# Altium schematic sheet board_Two.SchDoc
size A4; SheetNumber: 1; SheetTotal: 1
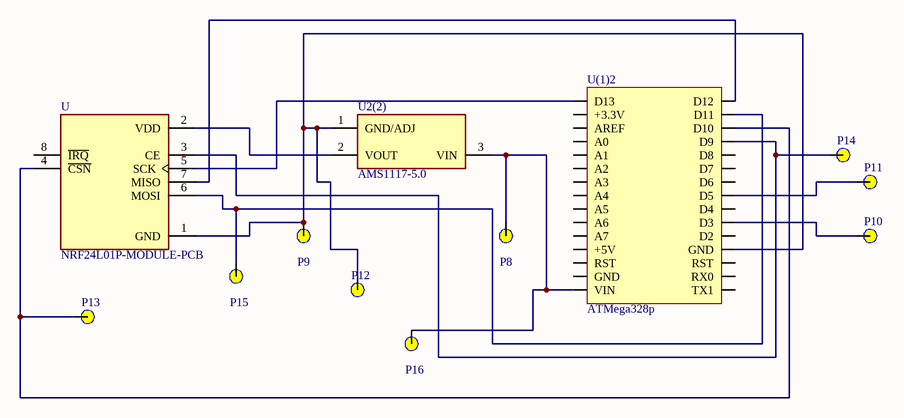
[diagram p0: board_Two.SchDoc]

## Parts
P8  PIN_1  [PCB_Pin_1]  (value not drawn)  (no BOM)
P9  PIN_1  [PCB_Pin_1]  (value not drawn)  (no BOM)
P10  PIN_1  [PCB_Pin_1]  (value not drawn)  (no BOM)
P11  PIN_1  [PCB_Pin_1]  (value not drawn)  (no BOM)
P12  PIN_1  [PCB_Pin_1]  (value not drawn)  (no BOM)
P13  PIN_1  [PCB_Pin_1]  (value not drawn)  (no BOM)
P14  PIN_1  [PCB_Pin_1]  (value not drawn)  (no BOM)
P15  PIN_1  [PCB_Pin_1]  (value not drawn)  (no BOM)
P16  PIN_1  [PCB_Pin_1]  (value not drawn)  (no BOM)
U  NRF24L01P-MODULE-PCB  [XCVR_NRF24L01P-MODULE-PCB]
U2(2)  AMS1117-5.0  [SOT229P700X180-4N]
U(1)2  ATMega328p  [PCB_ATMega328p]  (no BOM)

## Nets
NetP8_0: P8.0(Pin) P16.0(Pin) U2(2).3(VIN) U(1)2.0(VIN)
NetP9_0: P9.0(Pin) P12.0(Pin) U.1(GND) U2(2).1(GND/ADJ) U(1)2.26(GND)
NetP10_0: P10.0(Pin) U(1)2.24(D3)
NetP11_0: P11.0(Pin) U(1)2.22(D5)
NetP13_0: P13.0(Pin) U.4(~{CSN}) U(1)2.17(D10)
NetP14_0: P14.0(Pin) U.3(CE) U(1)2.18(D9)
NetP15_0: P15.0(Pin) U.6(MOSI) U(1)2.16(D11)
NetU_2: U.2(VDD) U2(2).2(VOUT)
NetU_5: U.5(SCK) U(1)2.14(D13)
NetU_7: U.7(MISO) U(1)2.15(D12)

Not connected (* = marked no-connect by the designer): U 8(~{IRQ}); U(1)2 1(GND) 2(RST) 3(+5V) 4(A7) 5(A6) 6(A5) 7(A4) 8(A3) 9(A2) 10(A1) 11(A0) 12(AREF) 13(+3.3V) 19(D8) 20(D7) 21(D6) 23(D4) 25(D2) 27(RST) 28(RX0) 29(TX1)

## Library data of the parts
U = NRF24L01P-MODULE-PCB: - Transceiver For Use With nRF24L01+; MF: Nordic Semiconductor; Package: None; MP: NRF24L01P-MODULE-PCB; Value: *; Availability: Bad; Price: None; SnapEDA_Link: https://www.snapeda.com/parts/NRF24L01P-MODULE-PCB/Nordic%20Semiconductor%20ASA/view-part/230534/?ref=snap; Mouser-Purchase-URL: https://snapeda.com/shop?store=Mouser&id=230534
U2(2) = AMS1117-5.0: 1A LOW DROPOUT VOLTAGE REGULATOR; MF: ams; MP: AMS1117-5.0; Package: SOT-223 Seeed Technology; SnapEDA_Link: https://www.snapeda.com/parts/AMS1117-5.0/ams/view-part/?ref=snap; Check_prices: https://www.snapeda.com/parts/AMS1117-5.0/ams/view-part/?ref=eda; Availability: Not in stock; Value: *; Price: None
U(1)2 = Arduino Nano: DCCduino Nano CH340 - аналог Arduino Nano v3.0 TYPE C